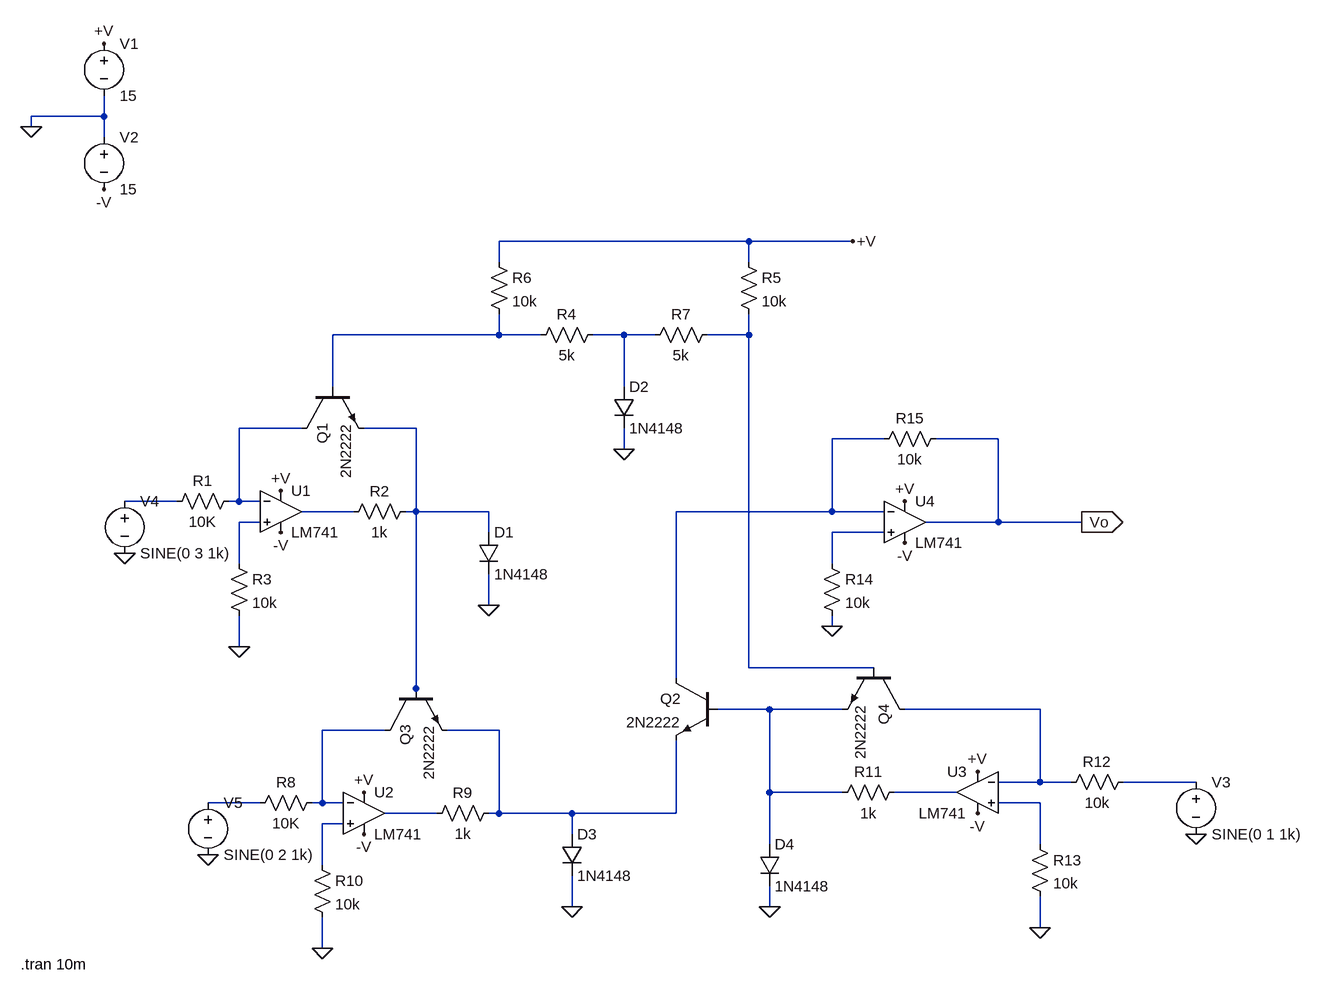
[diagram p0: schematic mul5.asc]
mul5.asc, the LTspice schematic file:
Version 4
SHEET 1 1712 916
WIRE -144 -448 -144 -480
WIRE -144 -448 -256 -448
WIRE -256 -432 -256 -448
WIRE -144 -416 -144 -448
WIRE 848 -256 464 -256
WIRE 1008 -256 848 -256
WIRE 464 -224 464 -256
WIRE 848 -224 848 -256
WIRE 464 -112 464 -144
WIRE 464 -112 208 -112
WIRE 528 -112 464 -112
WIRE 656 -112 608 -112
WIRE 704 -112 656 -112
WIRE 848 -112 848 -144
WIRE 848 -112 784 -112
WIRE 208 -32 208 -112
WIRE 656 -32 656 -112
WIRE 160 32 64 32
WIRE 336 32 256 32
WIRE 1056 48 976 48
WIRE 1232 48 1136 48
WIRE 656 64 656 32
WIRE -32 144 -112 144
WIRE 64 144 64 32
WIRE 64 144 48 144
WIRE 96 144 64 144
WIRE 240 160 160 160
WIRE 336 160 336 32
WIRE 336 160 320 160
WIRE 448 160 336 160
WIRE 976 160 976 48
WIRE 976 160 736 160
WIRE 1056 160 976 160
WIRE 96 176 64 176
WIRE 1232 176 1232 48
WIRE 1232 176 1120 176
WIRE 1360 176 1232 176
WIRE 448 192 448 160
WIRE 1056 192 976 192
WIRE 64 240 64 176
WIRE 976 240 976 192
WIRE 448 304 448 256
WIRE 976 336 976 320
WIRE 64 368 64 320
WIRE 848 400 848 -112
WIRE 1040 400 848 400
WIRE 736 416 736 160
WIRE 336 432 336 160
WIRE 336 448 336 432
WIRE 880 464 800 464
WIRE 992 464 880 464
WIRE 1296 464 1088 464
WIRE 288 496 192 496
WIRE 464 496 384 496
WIRE 1296 576 1296 464
WIRE 1296 576 1232 576
WIRE 1344 576 1296 576
WIRE 1536 576 1424 576
WIRE 880 592 880 464
WIRE 992 592 880 592
WIRE 1168 592 1072 592
WIRE 96 608 16 608
WIRE 192 608 192 496
WIRE 192 608 176 608
WIRE 224 608 192 608
WIRE 1296 608 1232 608
WIRE 368 624 288 624
WIRE 464 624 464 496
WIRE 464 624 448 624
WIRE 576 624 464 624
WIRE 736 624 736 512
WIRE 736 624 576 624
WIRE 224 640 192 640
WIRE 576 656 576 624
WIRE 880 672 880 592
WIRE 1296 672 1296 608
WIRE 192 704 192 640
WIRE 576 768 576 720
WIRE 880 768 880 736
WIRE 1296 800 1296 752
WIRE 192 832 192 784
FLAG 448 304 0
FLAG 64 368 0
FLAG 656 64 0
FLAG 576 768 0
FLAG 192 832 0
FLAG 880 768 0
FLAG 1296 800 0
FLAG 976 336 0
FLAG -256 -432 0
FLAG -144 -336 -V
FLAG -144 -560 +V
FLAG 1008 -256 +V
FLAG 128 128 +V
FLAG 256 592 +V
FLAG 1200 560 +V
FLAG 1088 144 +V
FLAG 128 192 -V
FLAG 256 656 -V
FLAG 1200 624 -V
FLAG 1088 208 -V
FLAG 1536 656 0
FLAG -112 224 0
FLAG 16 688 0
FLAG 1360 176 Vo
IOPIN 1360 176 Out
SYMBOL OpAmps\\LM741 128 96 R0
SYMATTR InstName U1
SYMBOL res 64 128 R90
WINDOW 0 0 56 VBottom 2
WINDOW 3 32 56 VTop 2
SYMATTR InstName R1
SYMATTR Value 10K
SYMBOL res 336 144 R90
WINDOW 0 0 56 VBottom 2
WINDOW 3 32 56 VTop 2
SYMATTR InstName R2
SYMATTR Value 1k
SYMBOL diode 432 192 R0
SYMATTR InstName D1
SYMATTR Value 1N4148
SYMBOL npn 160 -32 M90
SYMATTR InstName Q1
SYMATTR Value 2N2222
SYMBOL npn 800 416 M0
SYMATTR InstName Q2
SYMATTR Value 2N2222
SYMBOL res 48 224 R0
SYMATTR InstName R3
SYMATTR Value 10k
SYMBOL res 832 -240 R0
SYMATTR InstName R5
SYMATTR Value 10k
SYMBOL res 448 -240 R0
SYMATTR InstName R6
SYMATTR Value 10k
SYMBOL res 624 -128 R90
WINDOW 0 0 56 VBottom 2
WINDOW 3 32 56 VTop 2
SYMATTR InstName R4
SYMATTR Value 5k
SYMBOL res 800 -128 R90
WINDOW 0 0 56 VBottom 2
WINDOW 3 32 56 VTop 2
SYMATTR InstName R7
SYMATTR Value 5k
SYMBOL diode 640 -32 R0
SYMATTR InstName D2
SYMATTR Value 1N4148
SYMBOL OpAmps\\LM741 256 560 R0
SYMATTR InstName U2
SYMBOL res 192 592 R90
WINDOW 0 0 56 VBottom 2
WINDOW 3 32 56 VTop 2
SYMATTR InstName R8
SYMATTR Value 10K
SYMBOL res 464 608 R90
WINDOW 0 0 56 VBottom 2
WINDOW 3 32 56 VTop 2
SYMATTR InstName R9
SYMATTR Value 1k
SYMBOL diode 560 656 R0
SYMATTR InstName D3
SYMATTR Value 1N4148
SYMBOL npn 288 432 M90
SYMATTR InstName Q3
SYMATTR Value 2N2222
SYMBOL res 176 688 R0
SYMATTR InstName R10
SYMATTR Value 10k
SYMBOL diode 864 672 R0
SYMATTR InstName D4
SYMATTR Value 1N4148
SYMBOL res 1088 576 R90
WINDOW 0 0 56 VBottom 2
WINDOW 3 32 56 VTop 2
SYMATTR InstName R11
SYMATTR Value 1k
SYMBOL npn 1088 400 R90
SYMATTR InstName Q4
SYMATTR Value 2N2222
SYMBOL OpAmps\\LM741 1200 528 M0
SYMATTR InstName U3
SYMBOL res 1440 560 R90
WINDOW 0 0 56 VBottom 2
WINDOW 3 32 56 VTop 2
SYMATTR InstName R12
SYMATTR Value 10k
SYMBOL res 1280 656 R0
SYMATTR InstName R13
SYMATTR Value 10k
SYMBOL OpAmps\\LM741 1088 112 R0
SYMATTR InstName U4
SYMBOL res 960 224 R0
SYMATTR InstName R14
SYMATTR Value 10k
SYMBOL res 1152 32 R90
WINDOW 0 0 56 VBottom 2
WINDOW 3 32 56 VTop 2
SYMATTR InstName R15
SYMATTR Value 10k
SYMBOL voltage -144 -576 R0
WINDOW 123 0 0 Left 0
WINDOW 39 0 0 Left 0
SYMATTR InstName V1
SYMATTR Value 15
SYMBOL voltage -144 -432 R0
WINDOW 123 0 0 Left 0
WINDOW 39 0 0 Left 0
SYMATTR InstName V2
SYMATTR Value 15
SYMBOL voltage 1536 560 R0
WINDOW 123 0 0 Left 0
WINDOW 39 0 0 Left 0
SYMATTR InstName V3
SYMATTR Value SINE(0 1 1k)
SYMBOL voltage -112 128 R0
WINDOW 123 0 0 Left 0
WINDOW 39 0 0 Left 0
SYMATTR InstName V4
SYMATTR Value SINE(0 3 1k)
SYMBOL voltage 16 592 R0
WINDOW 123 0 0 Left 0
WINDOW 39 0 0 Left 0
SYMATTR InstName V5
SYMATTR Value SINE(0 2 1k)
TEXT -272 856 Left 2 !.tran 10m

The netlist it stands for:
* mul5.asc
XU1 N009 N004 +V -V N008 LM741  ; pins In+ In- V+ V- OUT
R1 N004 N007 10K
R2 N005 N008 1k
D1 N005 0 1N4148
Q1 N004 N001 N005 0 2N2222
Q2 N006 N011 N014 0 2N2222
R3 N009 0 10k
R5 +V N003 10k
R6 +V N001 10k
R4 N002 N001 5k
R7 N003 N002 5k
D2 N002 0 1N4148
XU2 N020 N013 +V -V N019 LM741  ; pins In+ In- V+ V- OUT
R8 N013 N017 10K
R9 N014 N019 1k
D3 N014 0 1N4148
Q3 N013 N005 N014 0 2N2222
R10 N020 0 10k
D4 N011 0 1N4148
R11 N016 N011 1k
Q4 N012 N003 N011 0 2N2222
XU3 N018 N012 +V -V N016 LM741  ; pins In+ In- V+ V- OUT
R12 N015 N012 10k
R13 N018 0 10k
XU4 N010 N006 +V -V Vo LM741  ; pins In+ In- V+ V- OUT
R14 N010 0 10k
R15 Vo N006 10k
V1 +V 0 15
V2 0 -V 15
V3 N015 0 SINE(0 1 1k)
V4 N007 0 SINE(0 3 1k)
V5 N017 0 SINE(0 2 1k)
.model D D
.lib standard.dio
.model NPN NPN
.model PNP PNP
.lib standard.bjt
.tran 10m
.lib LM741.lib
.backanno
.end